# Altium schematic sheet USB-C.SchDoc
size A; SheetNumber: 4; SheetTotal: 9
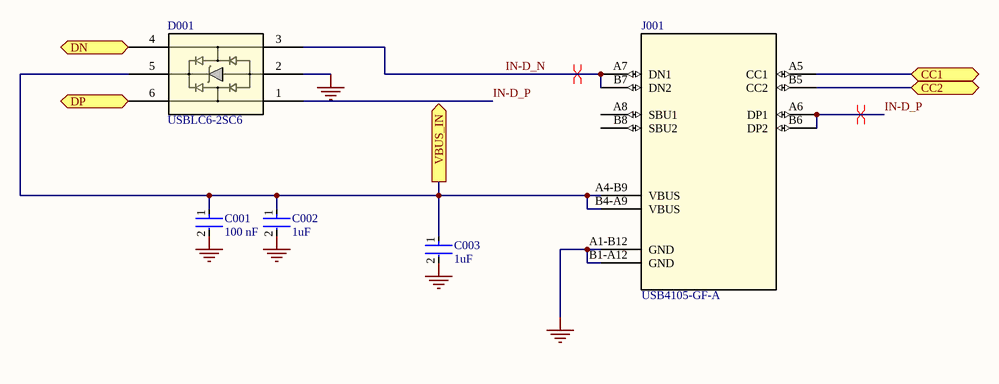
[diagram p0: USB-C.SchDoc]

## Parts
C001  100 nF  [FP-CC0201-BA-MFG]
C002  1uF  [FP-CL10-IPC_C]
C003  1uF  [FP-CL10-IPC_C]
D001  USBLC6-2SC6  [SOT23-6L_STM]
J001  USB4105-GF-A  [USB4105_GCT]

## Ports
CC1 (bidir, see Digital_Watch[1B], PMIC (nPM1300)[2A]), CC2 (bidir, see Digital_Watch[1B], PMIC (nPM1300)[2B]), DN (bidir, see Digital_Watch[1B], MCU (nrf5340)[5B]), DP (bidir, see Digital_Watch[1B], MCU (nrf5340)[5B]), VBUS_IN (out, see Digital_Watch[1B], PMIC (nPM1300)[1A])

## Nets
GND: C001.2 C002.2 C003.2 D001.2 J001.A1-B12(GND) J001.B1-A12(GND)
CC1: J001.A5(CC1) ; port CC1
CC2: J001.B5(CC2) ; port CC2
DN: D001.4 ; port DN
DP: D001.6 ; port DP
IN-D_N: D001.3 J001.A7(DN1) J001.B7(DN2)
IN-D_P: D001.1 J001.A6(DP1) J001.B6(DP2)
VBUS_IN: C001.1 C002.1 C003.1 D001.5 J001.A4-B9(VBUS) J001.B4-A9(VBUS) ; port VBUS_IN

Not connected (* = marked no-connect by the designer): J001 A8(SBU1) B8(SBU2)

## Layout directives
differential pair: IN-D_N, IN-D_P

## Library data of the parts
C001 = CMP-03422-001239-1: CAP CER 0.1UF 16V X5R 0201; Manufacturer Part Number: CC0201KRX5R7BB104; Manufacturer: Yageo; Material: Ceramic; Temperature Coefficient: 15%; Tolerance: 0.1; Value: 100 nF; Capacitance: 100 nF; Temperature Range Low: -55°C; Footprint Url: http://www.yageo.com/exep/pages/download/literatures/UPY-C_GEN_24.pdf; Automotive: No; Temperature Characteristic: X5R; Digikey Description: CAP CER 0.1UF 16V X5R 0201; Temperature: -55°C to +85°C; RoHS: TRUE; Mouser Description: Multilayer Ceramic Capacitors MLCC - SMD/SMT 100K nF X5R 10% 16 Volts; Height: 0.33mm; Category: Cap; ComponentLink2Description: Datasheet; Lead Free: Yes; Ipc Land Pattern Name: CAPC6030X30; Device Class L2: Capacitors; Temperature Range High: +85°C; Octopart: https://octopart.com/cc0201krx5r7bb104-yageo-57080722; Device Class L3: Ceramic Capacitors; Device Class L1: Passive Components; Package: CC0201-BA; ComponentLink2URL: http://www.yageo.com/documents/recent/UPY-GPHC_X5R_4V-to-50V_25.pdf; Voltage Rating: 16 V
C002 C003 = CMP-13271-002233-1: Cap Ceramic 1uF 10V X5R ±10% Pad SMD 0603 +85°C T/R; Radiation Hardening: No; Height: 0.8mm; Dielectric: X5R; Capacitance: 1uF; Mount: Surface Mount; Length: 1.6mm; Package Quantity: 10000; Tolerance: 10%; Voltage: 10V; Thickness: 0.035inch; Packaging: Tape and Reel; Lead Free: Lead Free; Voltage Rating (DC): 10V; Width: 0.031inch; Voltage Rating: 10V; Case/Package: 0603; Min Operating Temperature: -55°C; Max Operating Temperature: 85°C; Depth: 0.8mm
D001 = USBLC6-2SC6: 5A 17V 6V Unidirectional 5.25V SOT-23-6 ESD and Surge Protection (TVS/ESD) ROHS; Manufacturer: STMicroelectronics; Value: 2.5pF; Data Rate: 480Mbps; Element Configuration: Dual; ESD Protection: Yes; Forward Voltage: 1.1V; Leakage Current: 150nA; Max Junction Temperature (Tj): 125°C; Number of Bidirectional Channels: 2; Number of Elements: 1; Reverse Standoff Voltage: 5V; Test Current: 1mA; Supplier: Future Electronics; Supplier Part Number: USBLC6-2SC6; Manufacturer Part Number: USBLC6-2SC6; RoHS: Compliant; Category: TVS Diodes; Stock: 120000; Pricing: 3000=0.0806, 6000=0.0793, 12000=0.078, 15000=0.0776, 45000=0.075 (USD); Breakdown Voltage: 6V; Case/Package: SOT-23; China RoHS: Compliant; Clamping Voltage: 17V; Contact Plating: Tin; Country of Origin: Mainland China; Depth: 1.75mm; Direction: Unidirectional; Export Control Classification Number (ECCN) Code: EAR99; Height: 1.45mm; Harmonized Tariff Schedule (HTS) Code: 8541.10.00.50; Introduction Date: 2005-03-15; Lead Free: Lead Free; Length: 3.05mm; Lifecycle Status: Production; Max Breakdown Voltage: 6V; Max Operating Temperature: 125°C; Max Repetitive Reverse Voltage (Vrrm): 5.25V; Max Reverse Leakage Current: 150nA; Min Breakdown Voltage: 6V; Min Operating Temperature: -40°C; Mounting Technology: Surface Mount; Number of Channels: 2; Pins: 6; Number of Terminals: 6; Operating Supply Voltage: 1.1V; Peak Pulse Current: 5A; Peak Reverse Current: 150nA; Polarity: Unidirectional; Power Line Protection: Yes; Radiation Hardening: No; REACH SVHC: Yes; Reverse Breakdown Voltage: 6V; Schedule B: 8536300000, 8536300000|8536300000|8536300000|8536300000|8536300000|8536300000|8536300000|8536300000|8536300000|8536300000|8536300000|8536300000|8536300000|8536300000|8536300000|8536300000|8536300000|8536300000|8536300000|8536300000|8536300000|8536300000|8536300000|85; Termination: SMD/SMT; Width: 1.75mm; Working Voltage: 5V; ComponentLink1URL: https://datasheet.octopart.com:443/USBLC6-2SC6-STMicroelectronics-datasheet-10412581.pdf?src-supplier=Newark; ComponentLink1Description: https://datasheet.octopart.com:443/USBLC6-2SC6-STMicroelectronics-datasheet-10412581.pdf?src-supplier=Newark; ComponentLink2URL: https://datasheet.octopart.com:443/USBLC6-2SC6-STMicroelectronics-datasheet-181961833.pdf?src-supplier=Newark; ComponentLink2Description: https://datasheet.octopart.com:443/USBLC6-2SC6-STMicroelectronics-datasheet-181961833.pdf?src-supplier=Newark; ComponentLink3URL: https://datasheet.octopart.com:443/USBLC6-2SC6-STMicroelectronics-datasheet-525477.pdf?src-supplier=Factory+Futures; ComponentLink3Description: https://datasheet.octopart.com:443/USBLC6-2SC6-STMicroelectronics-datasheet-525477.pdf?src-supplier=Factory+Futures; ComponentLink4URL: https://datasheet.octopart.com:443/USBLC6-2SC6-STMicroelectronics-datasheet-82998616.pdf?src-supplier=Farnell; ComponentLink4Description: https://datasheet.octopart.com:443/USBLC6-2SC6-STMicroelectronics-datasheet-82998616.pdf?src-supplier=Farnell; ComponentLink5URL: https://datasheet.octopart.com:443/USBLC6-2SC6-STMicroelectronics-datasheet-46285.pdf?src-supplier=Farnell; ComponentLink5Description: https://datasheet.octopart.com:443/USBLC6-2SC6-STMicroelectronics-datasheet-46285.pdf?src-supplier=Farnell; ComponentLink6URL: https://datasheet.octopart.com:443/USBLC6-2SC6-STMicroelectronics-datasheet-14050643.pdf?src-supplier=iiiC; ComponentLink6Description: https://datasheet.octopart.com:443/USBLC6-2SC6-STMicroelectronics-datasheet-14050643.pdf?src-supplier=iiiC; ComponentLink7URL: https://datasheet.octopart.com:443/USBLC6-2SC6-STMicroelectronics-datasheet-10521292.pdf?src-supplier=Jameco; ComponentLink7Description: https://datasheet.octopart.com:443/USBLC6-2SC6-STMicroelectronics-datasheet-10521292.pdf?src-supplier=Jameco
J001 = USB4105-GF-A: USB Connector, 24 Contact(s), Female, Right Angle, Solder Terminal, Locking, Receptacle; Manufacturer: Global Connector Technology; Contact Resistance: 50mΩ; Current Rating: 6.25A; Dielectric Material: Liquid Crystal Polymer; Insulation Resistance: 100MΩ; Number of Contacts: 16; Number of Ports: 1; Number of Positions: 24; USB Standard: USB 2.0; Voltage Rating: 20V; Supplier: DigiKey; Supplier Part Number: 2073-USB4105-GF-ACT-ND; Manufacturer Part Number: USB4105-GF-A; RoHS: Compliant; Category: USB Connectors; Stock: 151521; Pricing: 1=0.8, 10=0.676, 25=0.6336, 50=0.6034, 100=0.5745, 250=0.53848, 800=0.49603, 1600=0.47234, 2400=0.45903, 4000=0.44278, 5600=0.43239, 8000=0.42165 (USD); China RoHS: Compliant; Contact Material: Gold, Nickel; Country of Origin: Mainland China; Export Control Classification Number (ECCN) Code: EAR99; Gender: Female; Height: 3.46mm; Harmonized Tariff Schedule (HTS) Code: 8536.69.40.30; Insulation Color: Black; Introduction Date: 2021-04-29; Lifecycle Status: Production; Max Operating Temperature: 85°C; Min Operating Temperature: -40°C; Pins: 16; Number of Rows: 1; Orientation: Right Angle; REACH SVHC: Yes; Shell Finish: Nickel; Shell Material: Stainless Steel; Terminal Pitch: 500µm; ComponentLink1URL: https://datasheet.octopart.com:443/USB4105-GF-A-GCT-datasheet-166929323.pdf?src-supplier=SOS+electronic; ComponentLink1Description: https://datasheet.octopart.com:443/USB4105-GF-A-GCT-datasheet-166929323.pdf?src-supplier=SOS+electronic; ComponentLink2URL: https://datasheet.octopart.com:443/USB4105-GF-A-GCT-datasheet-188935996.pdf?src-supplier=TME; ComponentLink2Description: https://datasheet.octopart.com:443/USB4105-GF-A-GCT-datasheet-188935996.pdf?src-supplier=TME; ComponentLink3URL: https://datasheet.octopart.com:443/USB4105-GF-A-GCT-datasheet-188869076.pdf?src-supplier=TME; ComponentLink3Description: https://datasheet.octopart.com:443/USB4105-GF-A-GCT-datasheet-188869076.pdf?src-supplier=TME; ComponentLink4URL: https://datasheet.octopart.com:443/USB4105-GF-A-GCT-datasheet-166927665.pdf?src-supplier=TME; ComponentLink4Description: https://datasheet.octopart.com:443/USB4105-GF-A-GCT-datasheet-166927665.pdf?src-supplier=TME; Supplier 1: DigiKey; Supplier Part Number 1: 2073-USB4105-GF-ACT-ND